# Altium schematic sheet v1.0.SchDoc
size 165 x 121 mm
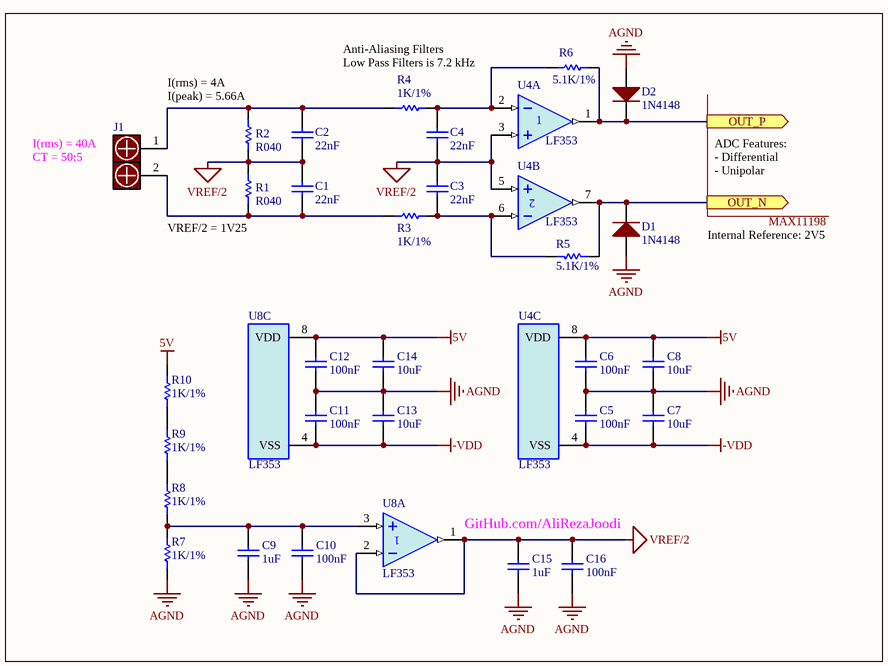
[diagram p0: v1.0.SchDoc]

## Parts
C1  22nF  [SMD_0805]
C2  22nF  [SMD_0805]
C3  22nF  [SMD_0805]
C4  22nF  [SMD_0805]
C5  100nF  [SMD_0805]
C6  100nF  [SMD_0805]
C7  10uF  [SMD_0805]
C8  10uF  [SMD_0805]
C9  1uF  [SMD_0805]
C10  100nF  [SMD_0805]
C11  100nF  [SMD_0805]
C12  100nF  [SMD_0805]
C13  10uF  [SMD_0805]
C14  10uF  [SMD_0805]
C15  1uF  [SMD_0805]
C16  100nF  [SMD_0805]
D1  1N4148  [SMD_DO-213AA]
D2  1N4148  [SMD_DO-213AA]
J1  (no value)  [1x2_P8.26]
R1  R040  [SMD_4527]
R2  R040  [SMD_4527]
R3  1K/1%  [SMD_0805]
R4  1K/1%  [SMD_0805]
R5  5.1K/1%  [SMD_0805]
R6  5.1K/1%  [SMD_0805]
R7  1K/1%  [SMD_0805]
R8  1K/1%  [SMD_0805]
R9  1K/1%  [SMD_0805]
R10  1K/1%  [SMD_0805]
U4  LF353  [SOIC127P600-8CM]  (parts A,B,C of 3)
U8  LF353  [SOIC127P600-8CM]  (parts A,C of 3)

## Ports
OUT_N (out), OUT_P (out)

## Nets
5V: C6.2 C8.1 C12.2 C14.1 R10.1 U4.8(VDD) U8.8(VDD)
-VDD: C5.1 C7.2 C11.1 C13.2 U4.4(VSS) U8.4(VSS)
AGND: C5.2 C6.1 C7.1 C8.2 C9.2 C10.1 C11.2 C12.1 C13.1 C14.2 C15.2 C16.1 D1.1(A) D2.1(A) R7.2
VREF/2: C1.1 C2.2 C3.1 C4.2 C15.1 C16.2 R1.2 R2.1 U4.3(IN+) U4.5(IN+) U8.1(OUT) U8.2(IN-)
OUT_N: D1.2(K) R5.1 U4.7(OUT) ; port OUT_N
OUT_P: D2.2(K) R6.1 U4.1(OUT) ; port OUT_P
NetC1_2: C1.2 J1.2 R1.1 R3.2
NetC2_1: C2.1 J1.1 R2.2 R4.2
NetC3_2: C3.2 R3.1 R5.2 U4.6(IN-)
NetC4_1: C4.1 R4.1 R6.2 U4.2(IN-)
NetC9_1: C9.1 C10.2 R7.1 R8.2 U8.3(IN+)
NetR8_1: R8.1 R9.2
NetR9_1: R9.1 R10.2

## Notes on the sheet
- Anti-Aliasing Filters
  Low Pass Filters is 7.2 kHz
- (near R2) I(rms) = 4A
  I(peak) = 5.66A
- (near J1) I(rms) = 40A
  CT = 50:5
- ADC Features:
  - Differential
  - Unipolar
- (near R1) VREF/2 = 1V25
- Internal Reference: 2V5
- MAX11198
- GitHub.com/AliRezaJoodi

## Library data of the parts
C1-C16 = Capacitor_Ceramic: Capacitor, Ceramic Multilayer, 25V, 10%; Revision: July-2002: Re-released for DXP Platform.
D1 D2 = Diode_2Form: Diode; Manufacturer: Microchip Technology; Part Number: 1N4148UR-1; Link: https://eu.mouser.com/ProductDetail/Microchip-Technology/1N4148UR-1?qs=%252BRKXB2WKlSdXiNZTe6I9fg%3D%3D
J1 = Connector1x2_Power_4Form: Connector, Barrier Terminal Blocks, 2Pin; Manufacturer: TE Connectivity; Part Number: 1977477-2; Link: https://eu.mouser.com/ProductDetail/TE-Connectivity/1977477-2?qs=94mdU9cNTDpZiO77z39FFw%3D%3D
R1 R2 = Resistor: Resistor, 2W, 1%; Manufacturer: Vishay / Dale; Part Number: WSR2R0400FEA; Revision: July-2002: Re-released for DXP Platform.; Link: https://eu.mouser.com/ProductDetail/Vishay-Dale/WSR2R0400FEA?qs=sGAEpiMZZMtlubZbdhIBIMgVGVS%252BbZOAbgAcZFEfOTY%3D
R3-R10 = Resistor: Resistor, 1/8W, 1%; Revision: July-2002: Re-released for DXP Platform.
U4 U8 = Op-Amp_Form1: IC, Op-Amp; Manufacturer: Texas Instruments; Part Number: LF353P; Link: https://eu.mouser.com/ProductDetail/Texas-Instruments/LF353P?qs=EIjG%252BN7kn%252BnHJN43AgArjw%3D%3D